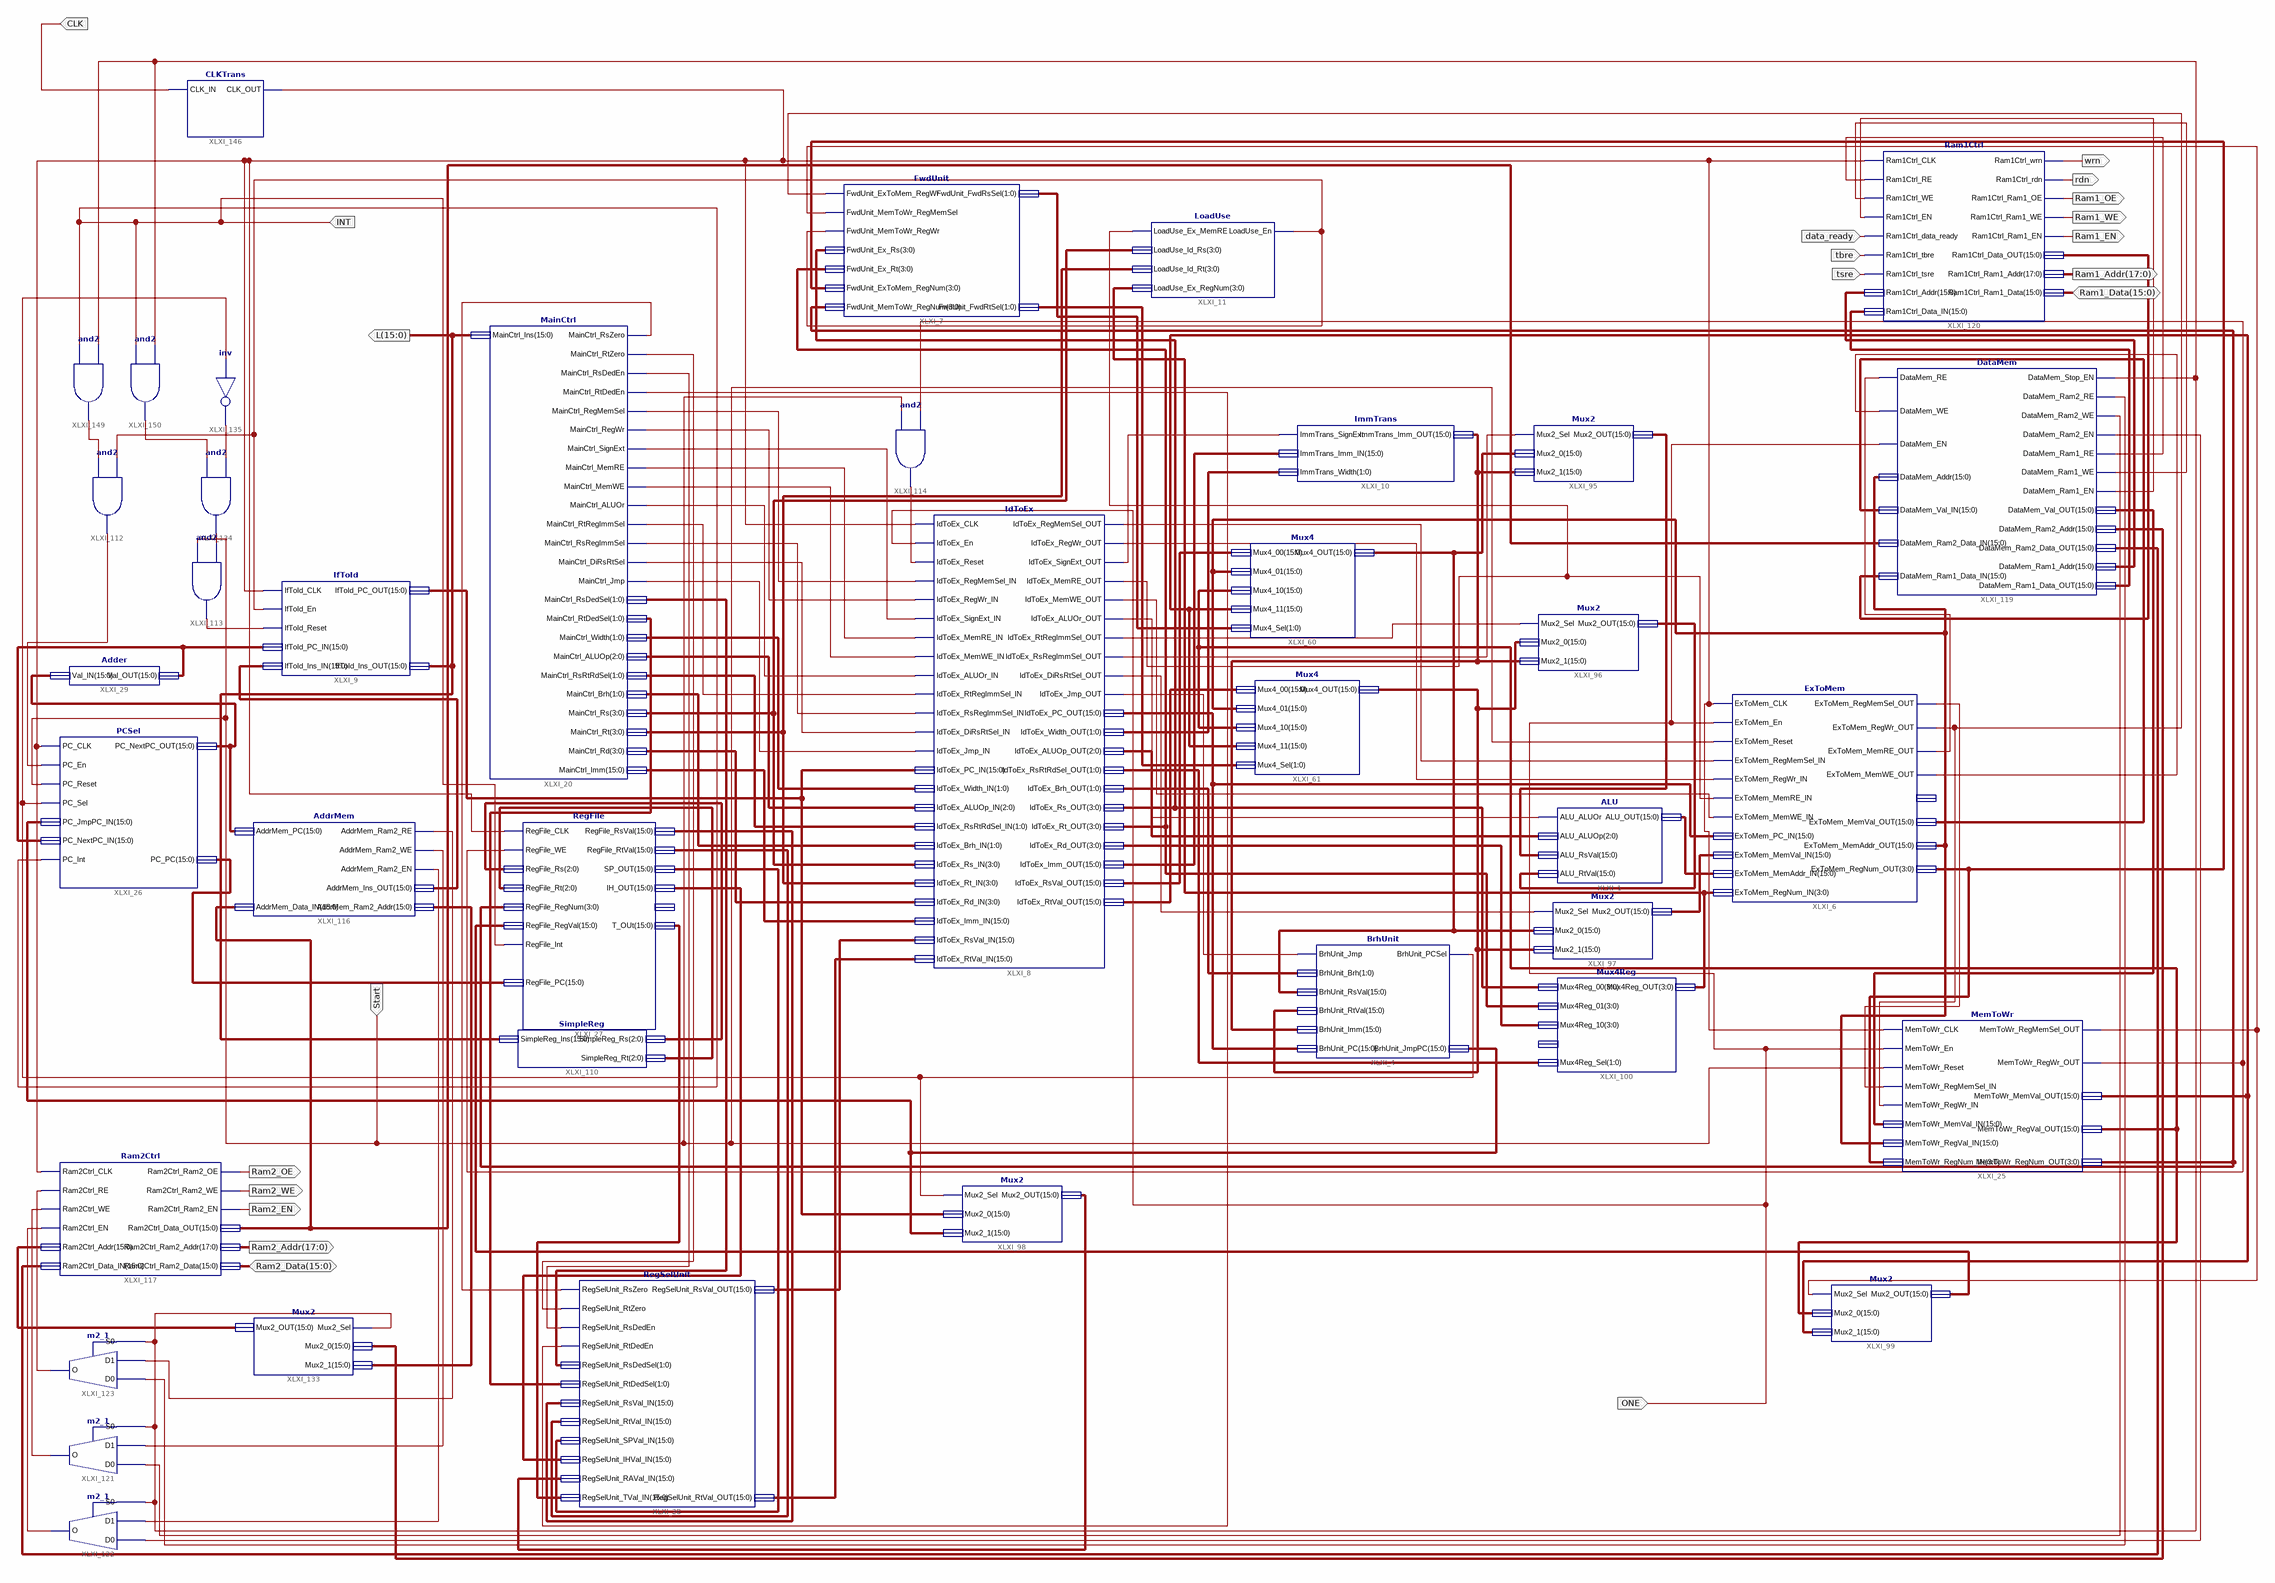
[diagram p0: schematic sheet 1]
// Xilinx ISE schematic CPU.sch (spartan3e) as structural Verilog: 39 symbols, 20 ports
module CPU (
  input  Start,
  input  data_ready,
  input  tbre,
  input  tsre,
  input  ONE,
  input  CLK,
  input  INT,
  inout  [15:0] Ram2_Data,
  inout  [15:0] Ram1_Data,
  output Ram2_OE,
  output Ram2_WE,
  output Ram2_EN,
  output [17:0] Ram2_Addr,
  output wrn,
  output rdn,
  output Ram1_OE,
  output Ram1_WE,
  output Ram1_EN,
  output [17:0] Ram1_Addr,
  output [15:0] L
);

  wire CLK_After, DYP0A, DYP0B, DYP0C, XLXN_29, XLXN_30, XLXN_31, XLXN_32, XLXN_36, XLXN_37, XLXN_38,
       XLXN_39, XLXN_40, XLXN_41, XLXN_43, XLXN_44, XLXN_78, XLXN_121, XLXN_243, XLXN_288, XLXN_291,
       XLXN_292, XLXN_322, XLXN_813, XLXN_824, XLXN_827, XLXN_828, XLXN_830, XLXN_846, XLXN_847, XLXN_848,
       XLXN_897, XLXN_984, XLXN_986, XLXN_991, XLXN_992, XLXN_1013, XLXN_1014, XLXN_1015, XLXN_1021,
       XLXN_1022, XLXN_1023, XLXN_1057, XLXN_1064, XLXN_10025, XLXN_10026, XLXN_10027, XLXN_10029,
       XLXN_10051, XLXN_10071, XLXN_10090, XLXN_10103, XLXN_10104;
  wire [1:0] DYP1A, XLXN_46, XLXN_47, XLXN_48, XLXN_50, XLXN_51, XLXN_94, XLXN_97, XLXN_1077, XLXN_10089;
  wire [2:0] XLXN_49, XLXN_286, XLXN_10110, XLXN_10111;
  wire [3:0] XLXN_52, XLXN_53, XLXN_54, XLXN_99, XLXN_100, XLXN_101, XLXN_238, XLXN_360, XLXN_10052;
  wire [15:0] XLXN_17, XLXN_55, XLXN_56, XLXN_57, XLXN_58, XLXN_60, XLXN_64, XLXN_71, XLXN_72, XLXN_102,
       XLXN_103, XLXN_142, XLXN_239, XLXN_297, XLXN_304, XLXN_319, XLXN_896, XLXN_920, XLXN_987, XLXN_988,
       XLXN_989, XLXN_1016, XLXN_1020, XLXN_1025, XLXN_1026, XLXN_1041, XLXN_1062, XLXN_10024, XLXN_10042,
       XLXN_10043, XLXN_10044, XLXN_10057, XLXN_10061, XLXN_10062, XLXN_10063, XLXN_10064, XLXN_10074,
       XLXN_10102, XLXN_10106, XLXN_10109;

  SimpleReg XLXI_110 (.SimpleReg_Ins(L), .SimpleReg_Rs(XLXN_10110), .SimpleReg_Rt(XLXN_10111));
  Mux4Reg XLXI_100 (
    .Mux4Reg_00(XLXN_99), .Mux4Reg_01(XLXN_100), .Mux4Reg_10(XLXN_101), .Mux4Reg_Sel(XLXN_97),
    .Mux4Reg_OUT(XLXN_10052));  // open: Mux4Reg_11
  Mux2 XLXI_99 (.Mux2_Sel(DYP0C), .Mux2_0(XLXN_304), .Mux2_1(XLXN_142), .Mux2_OUT(XLXN_239));
  Mux2 XLXI_98 (.Mux2_Sel(XLXN_10029), .Mux2_0(XLXN_896), .Mux2_1(XLXN_920), .Mux2_OUT(XLXN_64));
  Mux2 XLXI_97 (.Mux2_Sel(XLXN_848), .Mux2_0(XLXN_10044), .Mux2_1(XLXN_297), .Mux2_OUT(XLXN_319));
  Mux2 XLXI_96 (.Mux2_Sel(XLXN_291), .Mux2_0(XLXN_297), .Mux2_1(XLXN_1062), .Mux2_OUT(XLXN_10043));
  Mux2 XLXI_95 (.Mux2_Sel(XLXN_292), .Mux2_0(XLXN_10044), .Mux2_1(XLXN_1062), .Mux2_OUT(XLXN_10042));
  ExToMem XLXI_6 (
    .ExToMem_CLK(CLK_After), .ExToMem_En(ONE), .ExToMem_Reset(Start), .ExToMem_RegMemSel_IN(XLXN_121),
    .ExToMem_RegWr_IN(XLXN_847), .ExToMem_MemRE_IN(XLXN_322), .ExToMem_MemWE_IN(XLXN_78),
    .ExToMem_PC_IN(XLXN_10061), .ExToMem_MemVal_IN(XLXN_319), .ExToMem_MemAddr_IN(XLXN_10057),
    .ExToMem_RegNum_IN(XLXN_10052), .ExToMem_RegMemSel_OUT(XLXN_813), .ExToMem_RegWr_OUT(XLXN_10071),
    .ExToMem_MemRE_OUT(XLXN_991), .ExToMem_MemWE_OUT(XLXN_992), .ExToMem_MemVal_OUT(XLXN_10062),
    .ExToMem_MemAddr_OUT(XLXN_10063), .ExToMem_RegNum_OUT(XLXN_360));  // open: ExToMem_PC_OUT
  ALU XLXI_1 (
    .ALU_ALUOr(XLXN_288), .ALU_ALUOp(XLXN_286), .ALU_RsVal(XLXN_10042), .ALU_RtVal(XLXN_10043),
    .ALU_OUT(XLXN_10057));
  Mux4 XLXI_61 (
    .Mux4_00(XLXN_103), .Mux4_01(XLXN_10063), .Mux4_10(XLXN_304), .Mux4_11(XLXN_142), .Mux4_Sel(DYP1A),
    .Mux4_OUT(XLXN_297));
  Mux4 XLXI_60 (
    .Mux4_00(XLXN_102), .Mux4_01(XLXN_10063), .Mux4_10(XLXN_304), .Mux4_11(XLXN_142), .Mux4_Sel(XLXN_10089),
    .Mux4_OUT(XLXN_10044));
  BrhUnit XLXI_4 (
    .BrhUnit_Jmp(DYP0B), .BrhUnit_Brh(XLXN_1077), .BrhUnit_RsVal(XLXN_10044), .BrhUnit_RtVal(XLXN_297),
    .BrhUnit_Imm(XLXN_1062), .BrhUnit_PC(XLXN_10061), .BrhUnit_PCSel(XLXN_10029), .BrhUnit_JmpPC(XLXN_920));
  ImmTrans XLXI_10 (
    .ImmTrans_SignExt(XLXN_846), .ImmTrans_Imm_IN(XLXN_10064), .ImmTrans_Width(XLXN_94),
    .ImmTrans_Imm_OUT(XLXN_1062));
  PCSel XLXI_26 (
    .PC_CLK(CLK_After), .PC_En(XLXN_1064), .PC_Reset(Start), .PC_Sel(XLXN_10029), .PC_JmpPC_IN(XLXN_920),
    .PC_NextPC_IN(XLXN_17), .PC_NextPC_OUT(XLXN_10074), .PC_Int(INT), .PC_PC(XLXN_10106));
  IfToId XLXI_9 (
    .IfToId_CLK(CLK_After), .IfToId_En(XLXN_828), .IfToId_Reset(XLXN_827), .IfToId_PC_IN(XLXN_17),
    .IfToId_Ins_IN(XLXN_10102), .IfToId_PC_OUT(XLXN_896), .IfToId_Ins_OUT(L));
  FwdUnit XLXI_7 (
    .FwdUnit_ExToMem_RegWr(XLXN_10071), .FwdUnit_MemToWr_RegMemSel(DYP0C), .FwdUnit_MemToWr_RegWr(XLXN_243),
    .FwdUnit_Ex_Rs(XLXN_99), .FwdUnit_Ex_Rt(XLXN_100), .FwdUnit_ExToMem_RegNum(XLXN_360),
    .FwdUnit_MemToWr_RegNum(XLXN_238), .FwdUnit_FwdRsSel(XLXN_10089), .FwdUnit_FwdRtSel(DYP1A));
  LoadUse XLXI_11 (
    .LoadUse_Ex_MemRE(XLXN_322), .LoadUse_Id_Rs(XLXN_52), .LoadUse_Id_Rt(XLXN_53),
    .LoadUse_Ex_RegNum(XLXN_10052), .LoadUse_En(XLXN_828));
  MemToWr XLXI_25 (
    .MemToWr_CLK(CLK_After), .MemToWr_En(ONE), .MemToWr_Reset(Start), .MemToWr_RegMemSel_IN(XLXN_813),
    .MemToWr_RegWr_IN(XLXN_10071), .MemToWr_MemVal_IN(XLXN_1041), .MemToWr_RegVal_IN(XLXN_10063),
    .MemToWr_RegNum_IN(XLXN_360), .MemToWr_RegMemSel_OUT(DYP0C), .MemToWr_RegWr_OUT(XLXN_243),
    .MemToWr_MemVal_OUT(XLXN_142), .MemToWr_RegVal_OUT(XLXN_304), .MemToWr_RegNum_OUT(XLXN_238));
  IdToEx XLXI_8 (
    .IdToEx_CLK(CLK_After), .IdToEx_En(ONE), .IdToEx_Reset(XLXN_830), .IdToEx_RegMemSel_IN(XLXN_36),
    .IdToEx_RegWr_IN(XLXN_37), .IdToEx_SignExt_IN(XLXN_38), .IdToEx_MemRE_IN(XLXN_39),
    .IdToEx_MemWE_IN(XLXN_40), .IdToEx_ALUOr_IN(XLXN_41), .IdToEx_RtRegImmSel_IN(XLXN_897),
    .IdToEx_RsRegImmSel_IN(XLXN_43), .IdToEx_DiRsRtSel_IN(XLXN_44), .IdToEx_Jmp_IN(XLXN_10051),
    .IdToEx_PC_IN(XLXN_896), .IdToEx_Width_IN(XLXN_48), .IdToEx_ALUOp_IN(XLXN_49),
    .IdToEx_RsRtRdSel_IN(XLXN_50), .IdToEx_Brh_IN(XLXN_51), .IdToEx_Rs_IN(XLXN_52), .IdToEx_Rt_IN(XLXN_53),
    .IdToEx_Rd_IN(XLXN_54), .IdToEx_Imm_IN(XLXN_55), .IdToEx_RsVal_IN(XLXN_71), .IdToEx_RtVal_IN(XLXN_72),
    .IdToEx_RegMemSel_OUT(XLXN_121), .IdToEx_RegWr_OUT(XLXN_847), .IdToEx_SignExt_OUT(XLXN_846),
    .IdToEx_MemRE_OUT(XLXN_322), .IdToEx_MemWE_OUT(XLXN_78), .IdToEx_ALUOr_OUT(XLXN_288),
    .IdToEx_RtRegImmSel_OUT(XLXN_291), .IdToEx_RsRegImmSel_OUT(XLXN_292), .IdToEx_DiRsRtSel_OUT(XLXN_848),
    .IdToEx_Jmp_OUT(DYP0B), .IdToEx_PC_OUT(XLXN_10061), .IdToEx_Width_OUT(XLXN_94),
    .IdToEx_ALUOp_OUT(XLXN_286), .IdToEx_RsRtRdSel_OUT(XLXN_97), .IdToEx_Brh_OUT(XLXN_1077),
    .IdToEx_Rs_OUT(XLXN_99), .IdToEx_Rt_OUT(XLXN_100), .IdToEx_Rd_OUT(XLXN_101), .IdToEx_Imm_OUT(XLXN_10064),
    .IdToEx_RsVal_OUT(XLXN_102), .IdToEx_RtVal_OUT(XLXN_103));
  RegFile XLXI_27 (
    .RegFile_CLK(CLK_After), .RegFile_WE(XLXN_243), .RegFile_Int(INT), .RegFile_Rs(XLXN_10110),
    .RegFile_Rt(XLXN_10111), .RegFile_RegNum(XLXN_238), .RegFile_RegVal(XLXN_239), .RegFile_RsVal(XLXN_56),
    .RegFile_RtVal(XLXN_57), .SP_OUT(XLXN_58), .IH_OUT(XLXN_60), .T_OUt(XLXN_10109), .RegFile_PC(XLXN_10106));  // open: RA_OUT
  MainCtrl XLXI_20 (
    .MainCtrl_Ins(L), .MainCtrl_RsZero(XLXN_29), .MainCtrl_RtZero(XLXN_30), .MainCtrl_RsDedEn(XLXN_31),
    .MainCtrl_RtDedEn(XLXN_32), .MainCtrl_RegMemSel(XLXN_36), .MainCtrl_RegWr(XLXN_37),
    .MainCtrl_SignExt(XLXN_38), .MainCtrl_MemRE(XLXN_39), .MainCtrl_MemWE(XLXN_40), .MainCtrl_ALUOr(XLXN_41),
    .MainCtrl_RtRegImmSel(XLXN_897), .MainCtrl_RsRegImmSel(XLXN_43), .MainCtrl_DiRsRtSel(XLXN_44),
    .MainCtrl_Jmp(XLXN_10051), .MainCtrl_RsDedSel(XLXN_46), .MainCtrl_RtDedSel(XLXN_47),
    .MainCtrl_Width(XLXN_48), .MainCtrl_ALUOp(XLXN_49), .MainCtrl_RsRtRdSel(XLXN_50), .MainCtrl_Brh(XLXN_51),
    .MainCtrl_Rs(XLXN_52), .MainCtrl_Rt(XLXN_53), .MainCtrl_Rd(XLXN_54), .MainCtrl_Imm(XLXN_55));
  RegSelUnit XLXI_28 (
    .RegSelUnit_RsZero(XLXN_29), .RegSelUnit_RtZero(XLXN_30), .RegSelUnit_RsDedEn(XLXN_31),
    .RegSelUnit_RtDedEn(XLXN_32), .RegSelUnit_RsDedSel(XLXN_46), .RegSelUnit_RtDedSel(XLXN_47),
    .RegSelUnit_RsVal_IN(XLXN_56), .RegSelUnit_RtVal_IN(XLXN_57), .RegSelUnit_SPVal_IN(XLXN_58),
    .RegSelUnit_IHVal_IN(XLXN_60), .RegSelUnit_RAVal_IN(XLXN_64), .RegSelUnit_TVal_IN(XLXN_10109),
    .RegSelUnit_RsVal_OUT(XLXN_71), .RegSelUnit_RtVal_OUT(XLXN_72));
  Adder XLXI_29 (.Val_IN(XLXN_10074), .Val_OUT(XLXN_17));
  and XLXI_113 (XLXN_827, Start, XLXN_824);
  and XLXI_114 (XLXN_830, Start, XLXN_828);
  AddrMem XLXI_116 (
    .AddrMem_PC(XLXN_10074), .AddrMem_Data_IN(XLXN_10024), .AddrMem_Ram2_RE(XLXN_1013),
    .AddrMem_Ram2_WE(XLXN_1014), .AddrMem_Ram2_EN(XLXN_1015), .AddrMem_Ins_OUT(XLXN_10102),
    .AddrMem_Ram2_Addr(XLXN_1016));
  Ram2Ctrl XLXI_117 (
    .Ram2Ctrl_CLK(CLK_After), .Ram2Ctrl_RE(XLXN_10025), .Ram2Ctrl_WE(XLXN_10026), .Ram2Ctrl_EN(XLXN_10027),
    .Ram2Ctrl_Addr(XLXN_1020), .Ram2Ctrl_Data_IN(XLXN_1026), .Ram2Ctrl_Ram2_OE(Ram2_OE),
    .Ram2Ctrl_Ram2_WE(Ram2_WE), .Ram2Ctrl_Ram2_EN(Ram2_EN), .Ram2Ctrl_Data_OUT(XLXN_10024),
    .Ram2Ctrl_Ram2_Addr(Ram2_Addr), .Ram2Ctrl_Ram2_Data(Ram2_Data));
  DataMem XLXI_119 (
    .DataMem_RE(XLXN_991), .DataMem_WE(XLXN_992), .DataMem_EN(ONE), .DataMem_Addr(XLXN_10063),
    .DataMem_Val_IN(XLXN_10062), .DataMem_Ram2_Data_IN(XLXN_10024), .DataMem_Ram1_Data_IN(XLXN_989),
    .DataMem_Stop_EN(DYP0A), .DataMem_Ram2_RE(XLXN_1021), .DataMem_Ram2_WE(XLXN_1022),
    .DataMem_Ram2_EN(XLXN_1023), .DataMem_Ram1_RE(XLXN_984), .DataMem_Ram1_WE(XLXN_10090),
    .DataMem_Ram1_EN(XLXN_986), .DataMem_Val_OUT(XLXN_1041), .DataMem_Ram2_Addr(XLXN_1025),
    .DataMem_Ram2_Data_OUT(XLXN_1026), .DataMem_Ram1_Addr(XLXN_987), .DataMem_Ram1_Data_OUT(XLXN_988));
  Ram1Ctrl XLXI_120 (
    .Ram1Ctrl_CLK(CLK_After), .Ram1Ctrl_RE(XLXN_984), .Ram1Ctrl_WE(XLXN_10090), .Ram1Ctrl_EN(XLXN_986),
    .Ram1Ctrl_data_ready(data_ready), .Ram1Ctrl_tbre(tbre), .Ram1Ctrl_tsre(tsre), .Ram1Ctrl_Addr(XLXN_987),
    .Ram1Ctrl_Data_IN(XLXN_988), .Ram1Ctrl_wrn(wrn), .Ram1Ctrl_rdn(rdn), .Ram1Ctrl_Ram1_OE(Ram1_OE),
    .Ram1Ctrl_Ram1_WE(Ram1_WE), .Ram1Ctrl_Ram1_EN(Ram1_EN), .Ram1Ctrl_Data_OUT(XLXN_989),
    .Ram1Ctrl_Ram1_Addr(Ram1_Addr), .Ram1Ctrl_Ram1_Data(Ram1_Data));
  m2_1 XLXI_121 (.D0(XLXN_1022), .D1(XLXN_1014), .S0(DYP0A), .O(XLXN_10026));
  m2_1 XLXI_123 (.D0(XLXN_1021), .D1(XLXN_1013), .S0(DYP0A), .O(XLXN_10025));
  m2_1 XLXI_122 (.D0(XLXN_1023), .D1(XLXN_1015), .S0(DYP0A), .O(XLXN_10027));
  Mux2 XLXI_133 (.Mux2_Sel(DYP0A), .Mux2_0(XLXN_1025), .Mux2_1(XLXN_1016), .Mux2_OUT(XLXN_1020));
  not XLXI_135 (XLXN_1057, XLXN_10029);
  CLKTrans XLXI_146 (.CLK_IN(CLK), .CLK_OUT(CLK_After));
  and XLXI_112 (XLXN_1064, XLXN_10103, XLXN_828);
  and XLXI_134 (XLXN_824, XLXN_10104, XLXN_1057);
  and XLXI_149 (XLXN_10103, INT, DYP0A);
  and XLXI_150 (XLXN_10104, INT, DYP0A);
endmodule
